# EAGLE design Nixie6_IN-12A_1_0 (EAGLE 7.6.0)
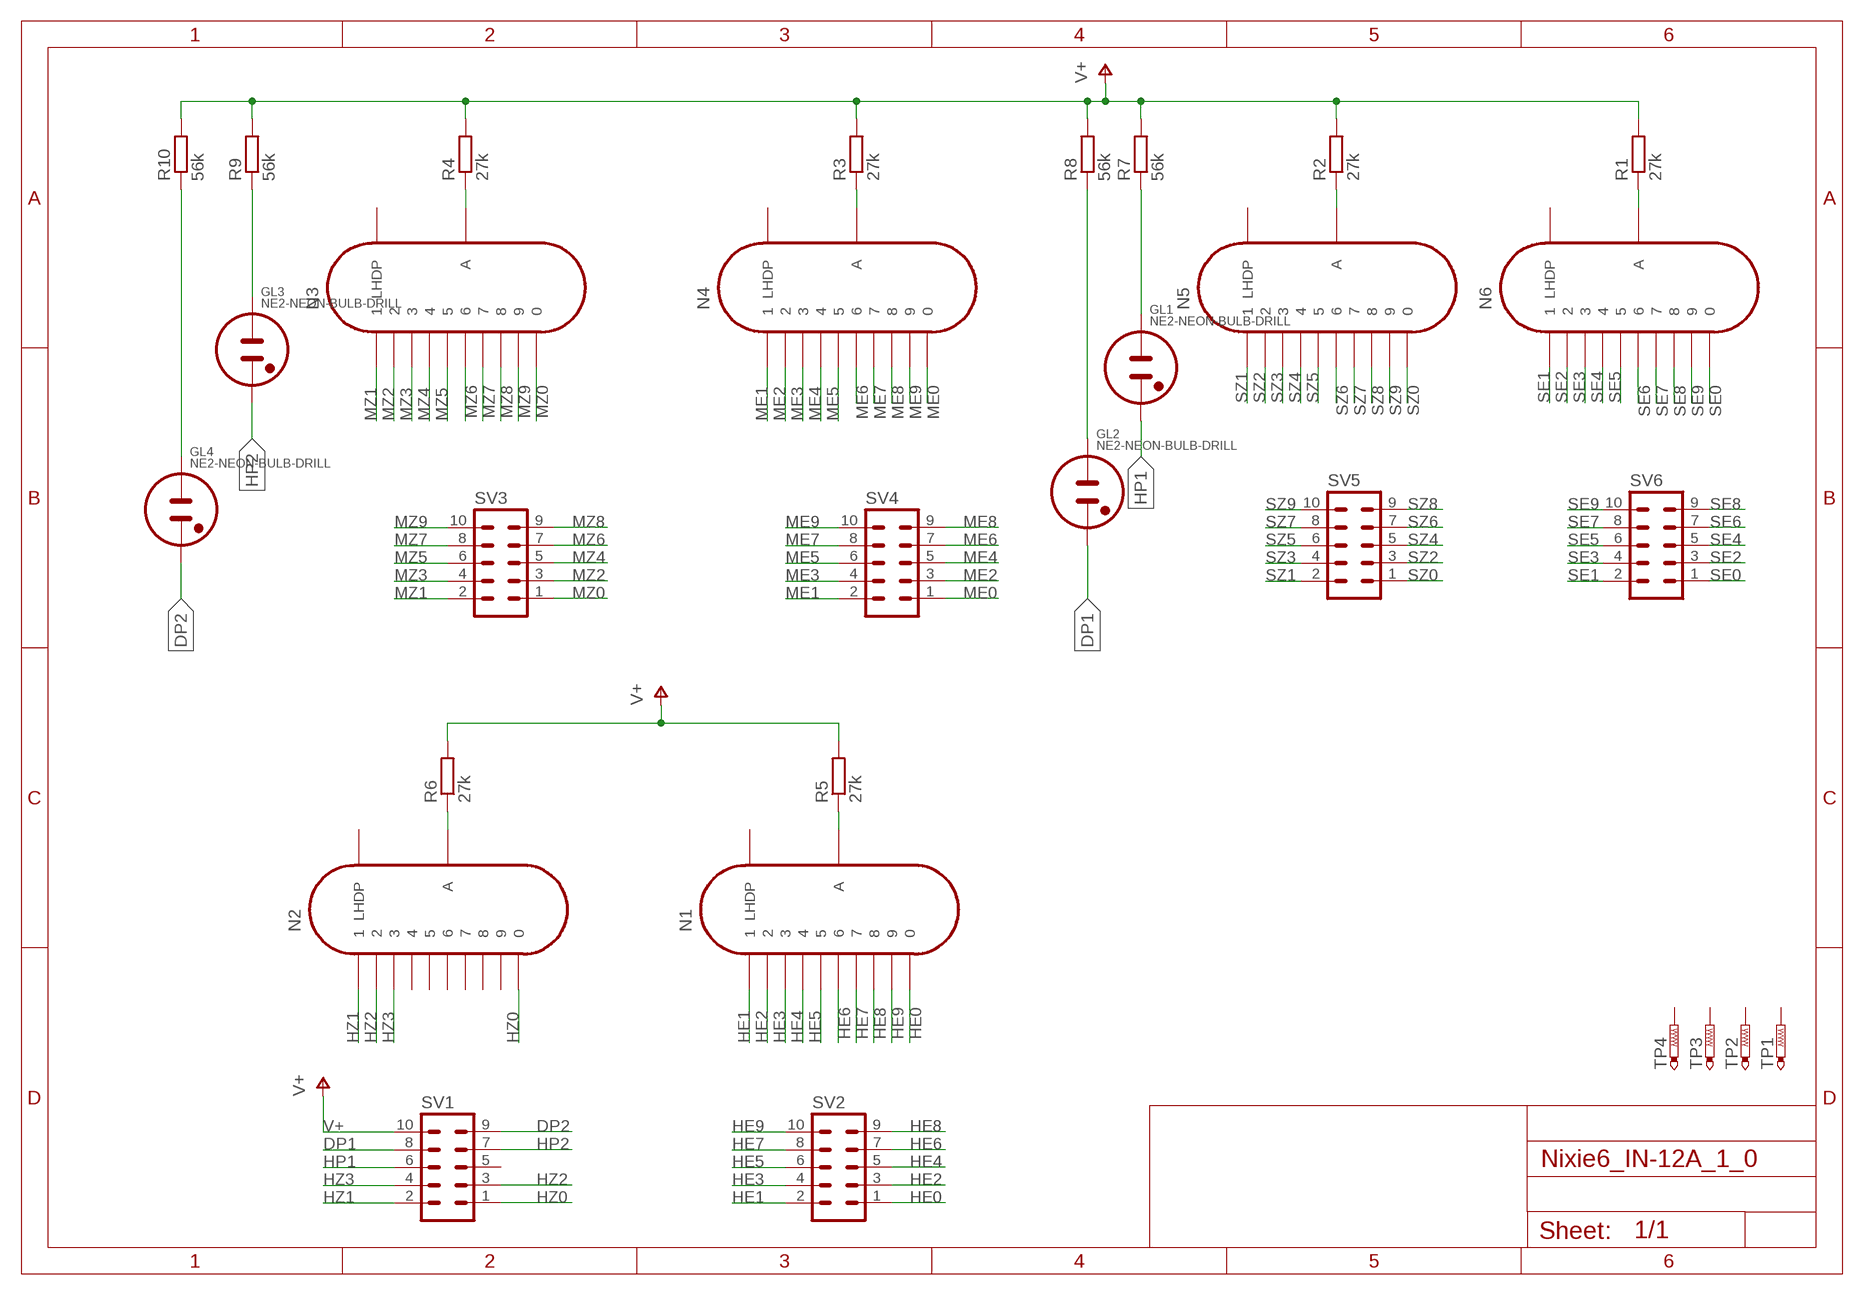
[diagram p0: schematic, sheet 1]

## Parts
GL1  NE2-NEON-BULB-DRILL  [NE2-NEON-BULB-DRILL]
GL2  NE2-NEON-BULB-DRILL  [NE2-NEON-BULB-DRILL]
GL3  NE2-NEON-BULB-DRILL  [NE2-NEON-BULB-DRILL]
GL4  NE2-NEON-BULB-DRILL  [NE2-NEON-BULB-DRILL]
N1  IN-12B  [IN-12]
N2  IN-12B  [IN-12]
N3  IN-12B  [IN-12]
N4  IN-12B  [IN-12]
N5  IN-12B  [IN-12]
N6  IN-12B  [IN-12]
R1  27k  R-EU_0207/10  [0207/10]
R2  27k  R-EU_0207/10  [0207/10]
R3  27k  R-EU_0207/10  [0207/10]
R4  27k  R-EU_0207/10  [0207/10]
R5  27k  R-EU_0207/10  [0207/10]
R6  27k  R-EU_0207/10  [0207/10]
R7  56k  R-EU_0207/10  [0207/10]
R8  56k  R-EU_0207/10  [0207/10]
R9  56k  R-EU_0207/10  [0207/10]
R10  56k  R-EU_0207/10  [0207/10]
SV1  ML10  [ML10]
SV2  ML10  [ML10]
SV3  ML10  [ML10]
SV4  ML10  [ML10]
SV5  ML10  [ML10]
SV6  ML10  [ML10]
TP1  PTR1B1,27  [B1,27]
TP2  PTR1B1,27  [B1,27]
TP3  PTR1B1,27  [B1,27]
TP4  PTR1B1,27  [B1,27]

## Nets
DP1: GL2.2(A1) SV1.8
DP2: GL4.2(A1) SV1.9
HE0: N1.0 SV2.1
HE1: N1.1 SV2.2
HE2: N1.2 SV2.3
HE3: N1.3 SV2.4
HE4: N1.4 SV2.5
HE5: N1.5 SV2.6
HE6: N1.6 SV2.7
HE7: N1.7 SV2.8
HE8: N1.8 SV2.9
HE9: N1.9 SV2.10
HP1: GL1.2(A1) SV1.6
HP2: GL3.2(A1) SV1.7
HZ0: N2.0 SV1.1
HZ1: N2.1 SV1.2
HZ2: N2.2 SV1.3
HZ3: N2.3 SV1.4
ME0: N4.0 SV4.1
ME1: N4.1 SV4.2
ME2: N4.2 SV4.3
ME3: N4.3 SV4.4
ME4: N4.4 SV4.5
ME5: N4.5 SV4.6
ME6: N4.6 SV4.7
ME7: N4.7 SV4.8
ME8: N4.8 SV4.9
ME9: N4.9 SV4.10
MZ0: N3.0 SV3.1
MZ1: N3.1 SV3.2
MZ2: N3.2 SV3.3
MZ3: N3.3 SV3.4
MZ4: N3.4 SV3.5
MZ5: N3.5 SV3.6
MZ6: N3.6 SV3.7
MZ7: N3.7 SV3.8
MZ8: N3.8 SV3.9
MZ9: N3.9 SV3.10
N$1: N2.A R6.1
N$2: N6.A R1.1
N$3: N5.A R2.1
N$4: N4.A R3.1
N$5: N3.A R4.1
N$6: GL2.1(A) R8.1
N$7: N1.A R5.1
N$8: GL1.1(A) R7.1
N$11: GL4.1(A) R10.1
N$13: GL3.1(A) R9.1
SE0: N6.0 SV6.1
SE1: N6.1 SV6.2
SE2: N6.2 SV6.3
SE3: N6.3 SV6.4
SE4: N6.4 SV6.5
SE5: N6.5 SV6.6
SE6: N6.6 SV6.7
SE7: N6.7 SV6.8
SE8: N6.8 SV6.9
SE9: N6.9 SV6.10
SZ0: N5.0 SV5.1
SZ1: N5.1 SV5.2
SZ2: N5.2 SV5.3
SZ3: N5.3 SV5.4
SZ4: N5.4 SV5.5
SZ5: N5.5 SV5.6
SZ6: N5.6 SV5.7
SZ7: N5.7 SV5.8
SZ8: N5.8 SV5.9
SZ9: N5.9 SV5.10
V+: R1.2 R2.2 R3.2 R4.2 R5.2 R6.2 R7.2 R8.2 R9.2 R10.2 SV1.10
Unconnected: N1.LHDP N2.4 N2.5 N2.6 N2.7 N2.8 N2.9 N2.LHDP N3.LHDP N4.LHDP N5.LHDP N6.LHDP SV1.5 TP1.TP TP2.TP TP3.TP TP4.TP

## Library data of the parts
GL1-GL4 = nixies:NE2-NEON-BULB: Neon indicator (wire connection)
N1-N6 = russian-nixies:IN-12B: IN-12B: medium numeric topview nixie tube
R1-R10 = rcl:R-EU_: RESISTOR, European symbol
SV1-SV6 = con-harting-ml:ML10: HARTING; OC_FARNELL: unknown; OC_NEWARK: unknown
TP1-TP4 = testpad:PTR1: TEST PIN

## Board
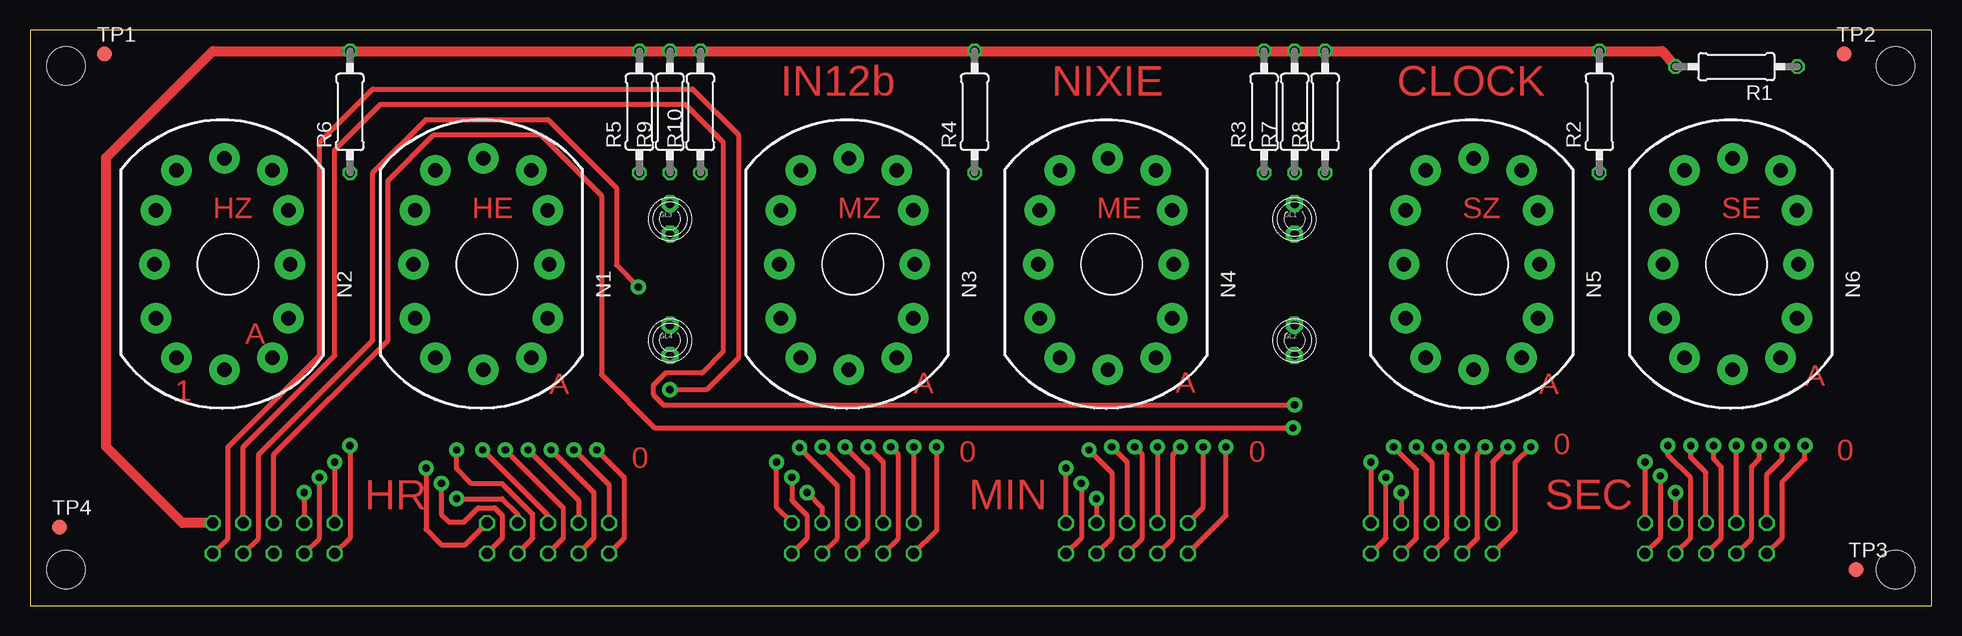
[diagram p1: board, top side]
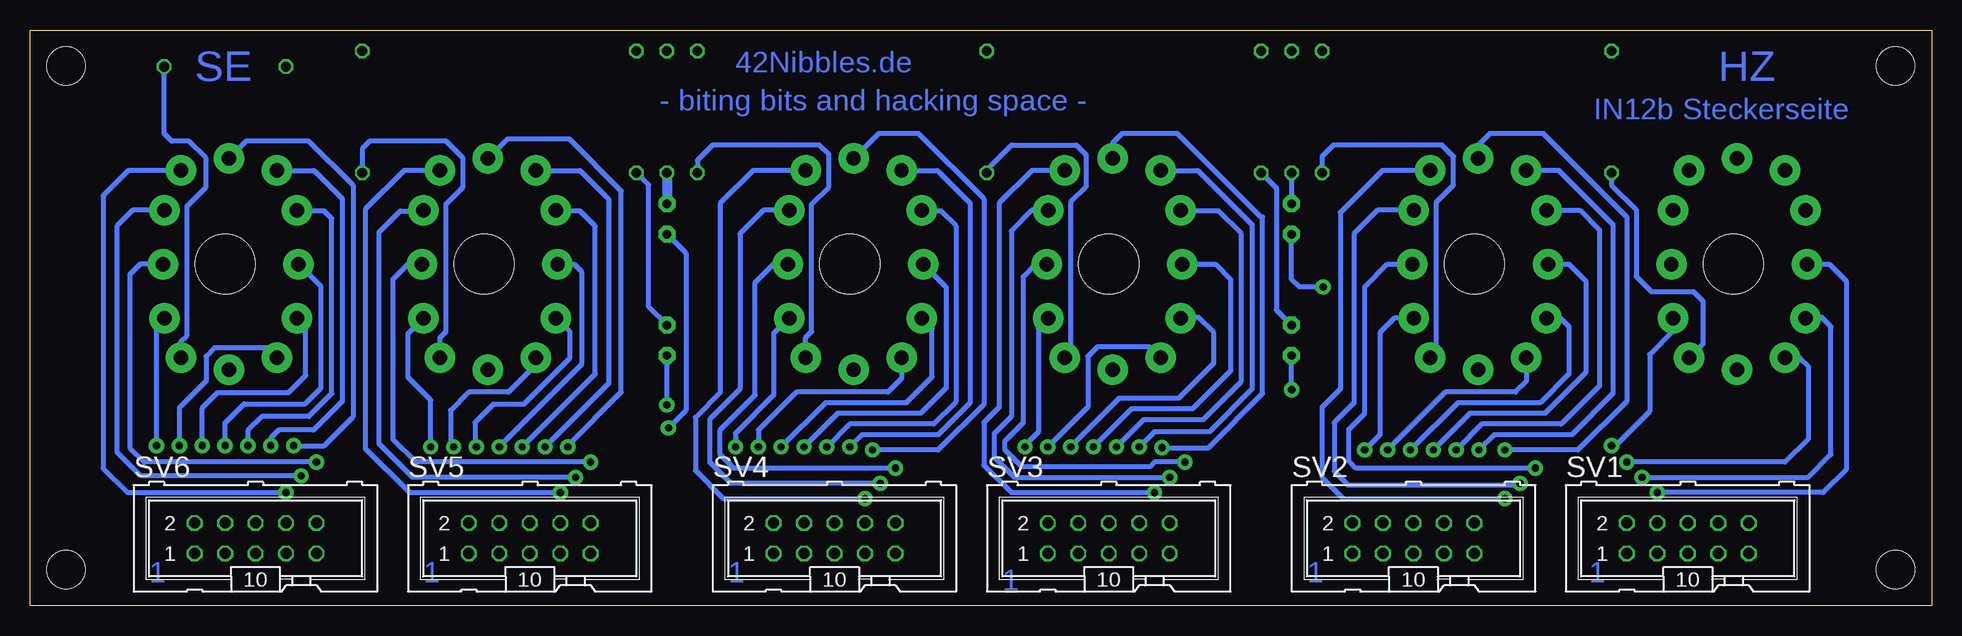
[diagram p2: board, bottom side, seen from below]

Size 158.5 x 48.01 mm. Coordinates in mm from the lower left corner, seen from the top.
Outline: 0,0 158.5,0 158.5,48 0,48.01 0,0
Copper layers (1*16): Top 0.035mm / dielectric 1.5mm / Bottom 0.035mm
Design rules "PCB-POOL Standard *": minimum track width 0.15mm, minimum drill 0.3mm, track to track 0.15mm, track to pad 0.15mm, pad to pad 0.15mm, via to via 0.15mm, smd to smd 0.15mm, copper to edge 0.3mm, drill to drill 0.2mm, minimum pad ring 0.2mm, minimum via ring 0.15mm, stop-mask expansion 0.075mm, vias tented up to drill 0mil, thermal gap 0.2mm
Holes 3.2 mm at 3,3 3,45 155.5,45 155.5,3

### Footprints (pad centres in the part's own frame; a part is rotated, then mirrored left to right if it is on the bottom)
NE2-NEON-BULB-DRILL = drill 0.7 pad 1.422 octagon: 1 0,1.27; 2 0,-1.27
IN-12 = drill 1.2 pad 2.54: 0 5.048,-4.5; 1 -4.317,-7.817; 2 -6,-4.5; 3 -6.127,0; 4 -6,4.5; 5 -4.317,7.817; 6 -0.318,8.818; 7 3.683,7.817; 8 5.048,4.5; 9 5.175,0; A 3.683,-7.817; LHDP -0.318,-8.818 | hole 5: 0,0
0207/10 = drill 0.813 octagon: 1 -5.08,0; 2 5.08,0
ML10 = drill 0.914 octagon: 1 -5.08,-1.27; 2 -5.08,1.27; 3 -2.54,-1.27; 4 -2.54,1.27; 5 0,-1.27; 6 0,1.27; 7 2.54,-1.27; 8 2.54,1.27; 9 5.08,-1.27; 10 5.08,1.27
B1,27 = smd 1.27 x 1.27: TP 0,0

### Placement (x,y rotation side)
GL1  105.41,32.25 0 top
GL2  105.41,22.13 0 top
GL3  53.34,32.25 0 top
GL4  53.34,22.13 0 top
N1  38.1,28.48 0 top
N2  16.51,28.48 0 top
N3  68.58,28.48 0 top
N4  90.17,28.48 0 top
N5  120.65,28.48 0 top
N6  142.24,28.48 0 top
R1  142.24,44.95 180 top
R2  130.81,41.18 90 top
R3  102.87,41.18 90 top
R4  78.74,41.18 90 top
R5  50.8,41.18 90 top
R6  26.67,41.18 90 top
R7  105.41,41.18 90 top
R8  107.95,41.18 90 top
R9  53.34,41.18 90 top
R10  55.88,41.18 90 top
SV1  20.32,5.62 0 bottom
SV2  43.18,5.62 0 bottom
SV3  68.58,5.62 0 bottom
SV4  91.44,5.62 0 bottom
SV5  116.84,5.62 0 bottom
SV6  139.7,5.62 0 bottom
TP1  6.2,46 0 top
TP2  151.2,46 0 top
TP3  152.2,3 0 top
TP4  2.47,6.54 0 top

### Tracks (layer width: path | path; a pad name or v marks a point on that pad's centre or on a via)
DP1  (via drill 0.6 pad 1.27)
  Top 0.406: SV1.8 17.78,13.24 25.4,20.86 25.4,38.01 29.21,41.81 54.61,41.81 57.78,38.64 57.78,21.18 56.01,19.4 52.96,19.4 51.94,18.38 51.94,17.62 52.83,16.73 v105.41,16.73
  Bottom 0.406: v105.41,16.73 GL2.2
DP2  (via drill 0.6 pad 1.27)
  Top 0.406: SV1.9 16.51,5.62 16.51,13.24 24.13,20.86 24.13,38.64 28.57,43.09 55.24,43.09 59.05,39.27 59.05,20.67 56.39,18 v53.34,18
  Bottom 0.406: v53.34,18 GL4.2
HE0  (via drill 0.6 pad 1.27)
  Top 0.406: SV2.1 49.53,5.62 49.53,10.7 v47.24,12.99
  Bottom 0.406: N1.0 44.76,23.98 45.97,22.77 45.97,14.26 v47.24,12.99
HE1  (via drill 0.6 pad 1.27)
  Top 0.406: v45.34,12.99 48.26,10.06 SV2.2
  Bottom 0.406: v45.34,12.99 40.51,17.81 34.67,17.81 33.78,18.7 N1.1
HE2  (via drill 0.6 pad 1.27)
  Top 0.406: SV2.3 46.99,5.62 46.99,9.43 v43.43,12.99
  Bottom 0.406: N1.2 30.93,23.98 30.23,23.27 30.23,19.3 32.61,16.92 39.5,16.92 v43.43,12.99
HE3  (via drill 0.6 pad 1.27)
  Top 0.406: v41.53,12.99 45.72,8.79 SV2.4
  Bottom 0.406: N1.3 30.23,28.48 28.83,27.08 28.83,19.43 32.23,16.03 38.48,16.03 v41.53,12.99
HE4  (via drill 0.6 pad 1.27)
  Top 0.406: SV2.5 44.45,5.62 44.45,8.16 v39.62,12.99
  Bottom 0.406: v39.62,12.99 37.47,15.14 30.86,15.14 27.69,18.32 27.69,31.34 29.33,32.98 N1.4
HE5  (via drill 0.6 pad 1.27)
  Top 0.406: SV2.6 43.18,7.53 v37.72,12.99
  Bottom 0.406: v37.72,12.99 36.45,14.26 29.97,14.26 26.54,17.68 26.54,31.78 31.06,36.3 N1.5
HE6  (via drill 0.6 pad 1.27)
  Top 0.406: SV2.7 41.91,5.62 41.91,7.62 39.37,10.16 36.83,10.16 35.56,11.43 v35.56,12.99
  Bottom 0.406: 35.88,12.67 v35.56,12.99 29.46,12.99 25.4,17.05 25.4,32.42 32.35,39.37 36.83,39.37 37.78,38.42 N1.6
HE7  (via drill 0.6 pad 1.27)
  Top 0.406: v35.56,8.92 39.37,8.92 40.64,7.65 SV2.8
  Bottom 0.406: N1.7 45.78,36.3 49.28,32.8 49.28,18.07 50.8,16.54 50.8,10.7 49.02,8.92 v35.56,8.92
HE8  (via drill 0.6 pad 1.27)
  Top 0.406: SV2.9 39.37,5.62 39.37,7.53 38.73,8.16 37.37,8.16 36.2,6.99 34.92,6.99 34.29,7.62 v34.29,10.19
  Bottom 0.406: N1.8 46.17,32.98 48.13,31.02 48.13,16.92 49.78,15.27 49.78,11.21 48.64,10.06 34.42,10.06 v34.29,10.19
HE9  (via drill 0.6 pad 1.27)
  Top 0.406: v33.02,11.46 33.02,6.35 34.29,5.08 36.29,5.08 SV2.10
  Bottom 0.406: N1.9 45.34,28.48 47.24,26.57 47.24,16.03 48.58,14.7 48.58,12.06 47.97,11.46 v33.02,11.46
HP1  (via drill 0.6 pad 1.27)
  Top 0.406: SV1.6 20.32,12.61 29.84,22.13 29.84,35.47 33.66,39.27 42.55,39.27 47.62,34.2 47.62,19.27 52.07,14.83 v105.28,14.83
  Bottom 0.406: v105.28,14.83 103.82,16.29 103.82,29.39 GL1.2
HP2  (via drill 0.6 pad 1.27)
  Top 0.406: SV1.7 19.05,5.62 19.05,12.61 28.57,22.13 28.57,36.1 33.02,40.55 43.18,40.55 48.9,34.83 48.9,28.39 v50.7,26.57
  Bottom 0.406: v50.7,26.57 52.7,26.57 53.34,27.21 GL3.2
HZ0  (via drill 0.6 pad 1.27)
  Top 0.406: v26.67,13.34 26.67,5.62 SV1.1
  Bottom 0.406: N2.0 21.56,22.89 23.5,20.95 23.5,16.2 26.36,13.34 v26.67,13.34
HZ1  (via drill 0.6 pad 1.27)
  Top 0.406: v25.4,11.97 SV1.2
  Bottom 0.406: N2.1 10.98,20.66 10.29,19.97 10.29,13.88 12.19,11.97 v25.4,11.97
HZ2  (via drill 0.6 pad 1.27)
  Top 0.406: SV1.3 24.13,5.62 v24.13,10.7
  Bottom 0.406: v24.13,10.7 10.29,10.7 8.38,12.61 8.38,23.27 9.14,24.04 10.46,24.04 N2.2
HZ3  (via drill 0.6 pad 1.27)
  Top 0.406: v22.86,9.43 SV1.4
  Bottom 0.406: N2.3 8.51,28.48 7.11,27.08 7.11,11.34 9.02,9.43 v22.86,9.43
ME0  (via drill 0.6 pad 1.27)
  Top 0.406: SV4.1 99.69,7.53 v99.69,13.24
  Bottom 0.406: v99.69,13.24 99.69,14.38 96.52,17.56 96.52,22.68 N4.0
ME1  (via drill 0.6 pad 1.27)
  Top 0.406: v97.79,13.24 97.79,8.16 SV4.2
  Bottom 0.406: N4.1 85.85,18.95 87,17.81 94.61,17.81 97.79,14.64 v97.79,13.24
ME2  (via drill 0.6 pad 1.27)
  Top 0.406: SV4.3 95.25,5.62 95.25,12.61 v95.89,13.24
  Bottom 0.406: N4.2 83.31,23.12 83.31,19.08 85.47,16.92 92.2,16.92 v95.89,13.24
ME3  (via drill 0.6 pad 1.27)
  Top 0.406: v93.98,13.24 SV4.4
  Bottom 0.406: v93.98,13.24 91.19,16.03 84.26,16.03 82.11,18.19 82.11,26.54 N4.3
ME4  (via drill 0.6 pad 1.27)
  Top 0.406: SV4.5 92.71,5.62 92.71,12.61 v92.08,13.24
  Bottom 0.406: N4.4 84.11,32.92 82.55,32.92 81.28,31.66 81.28,17.05 83.19,15.14 90.17,15.14 v92.08,13.24
ME5  (via drill 0.6 pad 1.27)
  Top 0.406: v90.17,13.24 91.44,11.97 SV4.6
  Bottom 0.406: v90.17,13.24 89.15,14.26 82.8,14.26 80.14,16.92 80.14,33.56 82.87,36.3 N4.5
ME6  (via drill 0.6 pad 1.27)
  Top 0.406: v88.27,12.99 90.17,11.08 90.17,5.62 SV4.7
  Bottom 0.406: v88.27,12.99 82.8,12.99 78.99,16.8 78.99,33.94 84.42,39.37 87.78,39.37 N4.6
ME7  (via drill 0.6 pad 1.27)
  Top 0.406: v88.9,8.92 SV4.8
  Bottom 0.406: N4.7 98.23,36.3 100.97,33.56 100.97,17.78 103.03,15.72 103.03,11.27 100.68,8.92 v88.9,8.92
ME8  (via drill 0.6 pad 1.27)
  Top 0.406: v87.63,10.19 87.63,5.62 SV4.9
  Bottom 0.406: N4.8 97.35,32.98 99.31,31.02 99.31,18.07 101.85,15.53 101.85,11.97 100.08,10.19 v87.63,10.19
ME9  (via drill 0.6 pad 1.27)
  Top 0.406: SV4.10 v86.36,11.46
  Bottom 0.406: v86.36,11.46 99.82,11.46 100.97,12.61 100.97,14.64 98.04,17.56 98.04,26.96 96.52,28.48 N4.9
MZ0  (via drill 0.6 pad 1.27)
  Top 0.406: v75.56,13.24 75.56,6.25 SV3.1
  Bottom 0.406: v75.56,13.24 75.56,13.37 74.45,14.48 74.45,23.15 N3.0
MZ1  (via drill 0.6 pad 1.27)
  Top 0.406: v73.66,13.24 SV3.2
  Bottom 0.406: N3.1 65.19,21.59 69.53,21.59 70.33,20.8 70.33,16.57 v73.66,13.24
MZ2  (via drill 0.6 pad 1.27)
  Top 0.406: SV3.3 72.39,5.62 72.39,12.61 v71.75,13.24
  Bottom 0.406: v71.75,13.24 67.69,17.3 62.74,17.3 59.82,20.23 59.82,22.77 61.09,24.04 62.52,24.04 N3.2
MZ3  (via drill 0.6 pad 1.27)
  Top 0.406: v69.85,13.24 71.12,11.97 SV3.4
  Bottom 0.406: N3.3 59.69,28.48 58.42,27.21 58.42,19.59 61.59,16.41 66.67,16.41 v69.85,13.24
MZ4  (via drill 0.6 pad 1.27)
  Top 0.406: SV3.5 69.85,5.62 69.85,11.34 v67.94,13.24
  Bottom 0.406: v67.94,13.24 65.66,15.53 60.71,15.53 57.53,18.7 57.53,31.02 59.44,32.92 62.52,32.92 N3.4
MZ5  (via drill 0.6 pad 1.27)
  Top 0.406: v66.04,13.24 68.58,10.7 SV3.6
  Bottom 0.406: N3.5 61.16,36.3 56.64,31.78 56.64,18.07 60.2,14.51 64.77,14.51 v66.04,13.24
MZ6  (via drill 0.6 pad 1.27)
  Top 0.406: SV3.7 67.31,5.62 67.31,10 v64.14,13.18
  Bottom 0.406: v64.14,13.18 60.26,13.18 55.75,17.68 55.75,32.42 55.91,32.42 62.87,39.37 67.47,39.37 68.26,38.58 N3.6
MZ7  (via drill 0.6 pad 1.27)
  Top 0.406: v64.77,9.43 66.04,8.16 SV3.8
  Bottom 0.406: N3.7 74.99,36.3 77.72,33.56 77.72,16.54 78.99,15.27 78.99,11.72 76.71,9.43 v64.77,9.43
MZ8  (via drill 0.6 pad 1.27)
  Top 0.406: v63.5,10.7 63.5,8.79 64.77,7.53 64.77,5.62 SV3.9
  Bottom 0.406: v63.5,10.7 76.45,10.7 78.11,12.35 78.11,14.38 76.71,15.78 76.71,31.27 75,32.98 N3.8
MZ9  (via drill 0.6 pad 1.27)
  Top 0.406: SV3.10 62.23,8.16 v62.23,11.97
  Bottom 0.406: v62.23,11.97 64.77,11.97 65.15,11.59 75.82,11.59 77.22,12.99 77.22,13.75 75.69,15.27 75.69,27.46 74.68,28.48 N3.9
N$1
  Bottom 0.406: R6.1 26.67,35.08 24.61,33.02 24.61,27.46 23.34,26.19 19.84,26.19 19.05,25.4 19.05,21.8 N2.A
N$2
  Bottom 0.406: N6.A 145.92,22.04 145.41,22.54 145.41,33.34 143.83,34.92 143.83,37.31 145.26,38.73 146.69,38.73 147.32,39.37 R1.1
N$3
  Bottom 0.406: N5.A 124.33,22.35 123.83,22.86 123.83,33.5 122.4,34.92 122.4,37.31 123.83,38.73 130.18,38.73 130.81,38.1 R2.1
N$4
  Bottom 0.406: N4.A 93.85,22.35 93.34,22.86 93.34,33.5 91.92,34.92 91.92,37.62 92.71,38.42 101.6,38.42 102.87,37.15 R3.1
N$5
  Bottom 0.406: R4.1 78.74,36.35 76.68,38.42 71.28,38.42 70.48,37.62 70.48,34.92 71.75,33.66 71.75,21.17 N3.A
N$6
  Bottom 0.406: R8.1 106.93,35.08 106.93,24.92 GL2.1
N$7
  Bottom 0.406: N1.A 41.27,21.17 41.27,33.66 39.85,35.08 39.85,37.47 40.8,38.42 49.85,38.42 50.8,37.47 R5.1
N$8
  Bottom 0.813: R7.1 GL1.1
N$11
  Bottom 0.406: R10.1 54.61,34.83 54.61,24.67 GL4.1
N$13
  Bottom 0.406: R9.1 GL3.1
SE0  (via drill 0.6 pad 1.27)
  Top 0.406: SV6.1 146.05,5.62 146.05,10.32 147.96,12.22 v147.96,13.34
  Bottom 0.406: v147.96,13.34 147.96,23.31 N6.0
SE1  (via drill 0.6 pad 1.27)
  Top 0.406: SV6.2 144.78,10.95 146.05,12.22 v146.05,13.34
  Bottom 0.406: N6.1 138.75,21.5 143.13,21.5 143.83,20.8 143.83,18.73 146.05,16.51 v146.05,13.34
SE2  (via drill 0.6 pad 1.27)
  Top 0.406: SV6.3 143.51,5.62 143.51,11.59 144.15,12.22 v144.15,13.34
  Bottom 0.406: N6.2 135.51,23.25 135.51,19.21 136.94,17.78 142.88,17.78 144.15,16.51 v144.15,13.34
SE3  (via drill 0.6 pad 1.27)
  Top 0.406: SV6.4 v142.24,13.34
  Bottom 0.406: v142.24,13.34 142.24,15.24 140.65,16.83 135.57,16.83 134.24,18.16 134.24,26.61 N6.3
SE4  (via drill 0.6 pad 1.27)
  Top 0.406: SV6.5 140.97,5.62 140.97,11.59 140.34,12.22 v140.34,13.34
  Bottom 0.406: N6.4 136.19,32.92 133.99,32.92 133.35,32.29 133.35,17.68 135.25,15.78 139.16,15.78 140.34,14.61 v140.34,13.34
SE5  (via drill 0.6 pad 1.27)
  Top 0.406: SV6.6 139.7,11.11 138.43,12.38 v138.43,13.34
  Bottom 0.406: N6.5 134.82,36.3 132.46,33.94 132.46,17.05 134.87,14.64 137.76,14.64 138.43,13.97 v138.43,13.34
SE6  (via drill 0.6 pad 1.27)
  Top 0.406: SV6.7 138.43,5.62 138.43,10.64 136.53,12.54 v136.53,13.34
  Bottom 0.406: v136.53,13.34 133.99,13.34 131.57,15.75 131.57,35.05 135.25,38.73 140.49,38.73 N6.6
SE7  (via drill 0.6 pad 1.27)
  Top 0.406: v137.16,9.43 SV6.8
  Bottom 0.406: N6.7 150.3,36.3 152.4,34.2 152.4,11.46 150.37,9.43 v137.16,9.43
SE8  (via drill 0.6 pad 1.27)
  Top 0.406: v135.89,10.83 135.89,5.62 SV6.9
  Bottom 0.406: N6.8 149.93,32.98 151.26,31.66 151.26,12.83 149.26,10.83 v135.89,10.83
SE9  (via drill 0.6 pad 1.27)
  Top 0.406: v134.62,11.97 SV6.10
  Bottom 0.406: N6.9 149.32,28.48 150.18,27.62 150.18,13.18 148.97,11.97 v134.62,11.97
SZ0  (via drill 0.6 pad 1.27)
  Top 0.406: SV5.1 123.83,6.25 123.83,11.97 v125.09,13.24
  Bottom 0.406: v125.09,13.24 125.09,17.14 127,19.05 127,22.68 N5.0
SZ1  (via drill 0.6 pad 1.27)
  Top 0.406: v123.19,13.24 121.92,11.97 SV5.2
  Bottom 0.406: N5.1 116.33,20.1 118.62,17.81 121.92,17.81 123.44,16.29 123.44,13.49 v123.19,13.24
SZ2  (via drill 0.6 pad 1.27)
  Top 0.406: SV5.3 120.65,5.62 120.65,12.61 v121.28,13.24
  Bottom 0.406: N5.2 114.63,23.98 113.54,22.89 113.54,20.61 117.35,16.8 119.89,16.8 121.41,15.27 121.41,13.37 v121.28,13.24
SZ3  (via drill 0.6 pad 1.27)
  Top 0.406: v119.38,13.24 SV5.4
  Bottom 0.406: N5.3 113.16,28.48 112.52,27.84 112.52,20.1 v119.38,13.24
SZ4  (via drill 0.6 pad 1.27)
  Top 0.406: SV5.5 118.11,5.62 118.11,12.61 v117.47,13.24
  Bottom 0.406: N5.4 114.59,32.92 112.65,32.92 111.38,31.66 111.38,19.34 v117.47,13.24
SZ5  (via drill 0.6 pad 1.27)
  Top 0.406: v115.57,13.24 116.84,11.97 SV5.6
  Bottom 0.406: v115.57,13.24 110.24,18.57 110.24,33.88 110.33,33.97 110.57,34.21 112.66,36.3 N5.5
SZ6  (via drill 0.6 pad 1.27)
  Top 0.406: SV5.7 115.57,5.62 115.57,11.34 v113.67,13.24
  Bottom 0.406: v113.67,13.24 113.67,13.37 109.22,17.81 109.22,34.58 113.54,38.89 118.74,38.89 N5.6
SZ7  (via drill 0.6 pad 1.27)
  Top 0.406: v114.3,9.43 SV5.8
  Bottom 0.406: N5.7 127.31,36.3 130.56,33.05 130.56,13.11 126.87,9.43 v114.3,9.43
SZ8  (via drill 0.6 pad 1.27)
  Top 0.406: SV5.9 113.03,5.62 v113.03,10.7
  Bottom 0.406: v113.03,10.7 126.62,10.7 129.41,13.49 129.41,31.15 127.64,32.92 125.75,32.92 N5.8
SZ9  (via drill 0.6 pad 1.27)
  Top 0.406: v111.76,11.97 SV5.10
  Bottom 0.406: N5.9 127,28.48 128.27,27.21 128.27,13.88 126.36,11.97 v111.76,11.97
V+
  Top 0.813: SV1.10 12.7,6.89 6.35,13.24 6.35,37.37 15.24,46.26 R6.2 R5.2 R9.2 R10.2 R4.2 R3.2 R7.2 R8.2 R2.2 136.05,46.26 R1.2

### Text on the board
Top: IN12b | NIXIE | CLOCK | HZ | HE | MZ | ME | SZ | SE | A | A | A | A | A | A | 1 | 0 | 0 | 0 | 0 | 0 | HR | MIN | SEC
Bottom: HZ | 42Nibbles.de | SE | IN12b Steckerseite | - biting bits and hacking space - | 1 | 1 | 1 | 1 | 1 | 1